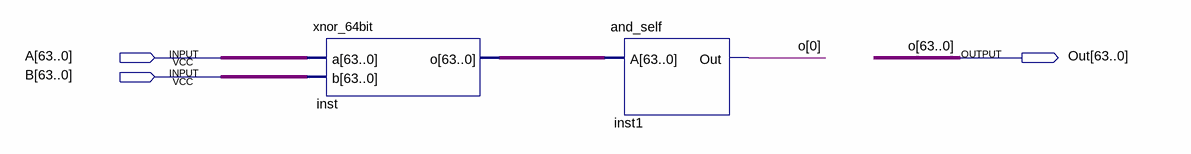
[diagram p0: schematic sheet]
// Quartus schematic isequal_64bit.bdf as structural Verilog: 2 symbols, 3 pins
module isequal_64bit (
  input  [63:0] A,
  input  [63:0] B,
  output [63:0] Out
);

  wire [63:0] inst_o;

  xnor_64bit inst (.a(A), .b(B), .o(inst_o));
  and_self inst1 (.A(inst_o), .Out(Out[0]));

  // Other names for the same wires on the sheet: o[63:0] = Out
endmodule
